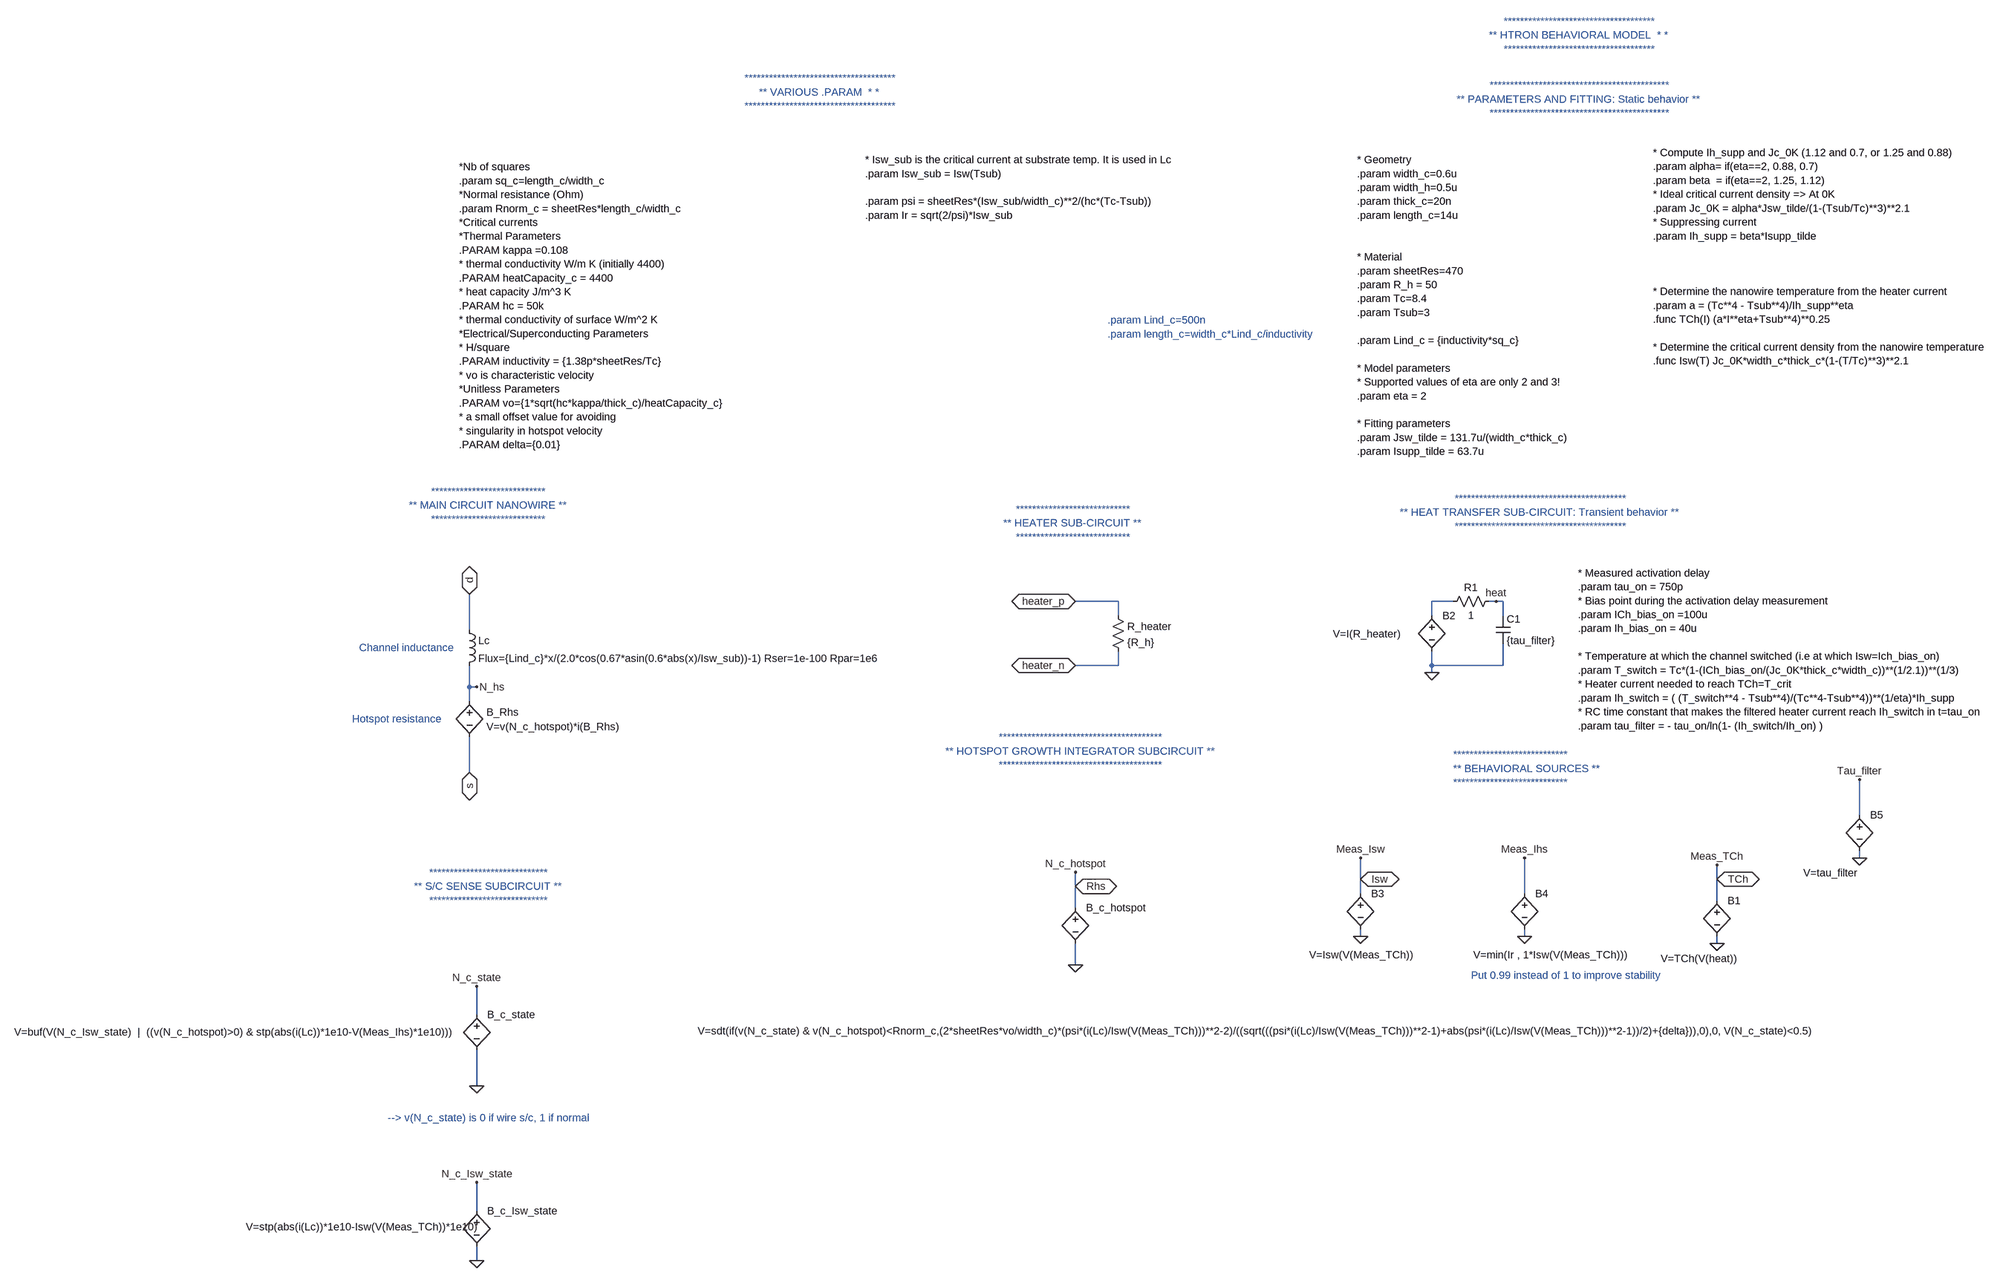
[diagram p0: schematic htron_behavioral_debug.asc]
htron_behavioral_debug.asc, the LTspice schematic file:
Version 4
SHEET 1 6584 3032
WIRE 3776 1136 3680 1136
WIRE 4528 1136 4480 1136
WIRE 4624 1136 4608 1136
WIRE 4640 1136 4624 1136
WIRE 3776 1168 3776 1136
WIRE 4480 1168 4480 1136
WIRE 4640 1168 4640 1136
WIRE 2320 1200 2320 1120
WIRE 3776 1280 3776 1248
WIRE 3776 1280 3680 1280
WIRE 4480 1280 4480 1248
WIRE 4640 1280 4640 1232
WIRE 4640 1280 4480 1280
WIRE 4480 1296 4480 1280
WIRE 2320 1328 2320 1280
WIRE 2336 1328 2320 1328
WIRE 2320 1360 2320 1328
WIRE 2320 1520 2320 1440
WIRE 5440 1616 5440 1536
WIRE 5440 1712 5440 1696
WIRE 4320 1760 4320 1712
WIRE 5120 1760 5120 1728
WIRE 3680 1776 3680 1744
WIRE 4320 1792 4320 1760
WIRE 4688 1792 4688 1712
WIRE 5120 1808 5120 1760
WIRE 3680 1824 3680 1776
WIRE 4320 1888 4320 1872
WIRE 4688 1888 4688 1872
WIRE 5120 1904 5120 1888
WIRE 3680 1952 3680 1904
WIRE 2336 2064 2336 2000
WIRE 2336 2224 2336 2144
WIRE 2336 2608 2336 2544
WIRE 2336 2720 2336 2688
FLAG 2336 2224 0
FLAG 2336 2000 N_c_state
FLAG 2336 1328 N_hs
FLAG 4688 1888 0
FLAG 4688 1712 Meas_Ihs
FLAG 5120 1904 0
FLAG 5120 1728 Meas_TCh
FLAG 2336 2720 0
FLAG 2336 2544 N_c_Isw_state
FLAG 3680 1952 0
FLAG 3680 1744 N_c_hotspot
FLAG 4480 1296 0
FLAG 2320 1120 d
IOPIN 2320 1120 BiDir
FLAG 3680 1136 heater_p
IOPIN 3680 1136 BiDir
FLAG 3680 1280 heater_n
IOPIN 3680 1280 BiDir
FLAG 2320 1520 s
IOPIN 2320 1520 BiDir
FLAG 4624 1136 heat
FLAG 4320 1888 0
FLAG 4320 1712 Meas_Isw
FLAG 4320 1760 Isw
IOPIN 4320 1760 BiDir
FLAG 5120 1760 TCh
IOPIN 5120 1760 BiDir
FLAG 3680 1776 Rhs
IOPIN 3680 1776 BiDir
FLAG 5440 1712 0
FLAG 5440 1536 Tau_filter
SYMBOL ind 2304 1184 R0
SYMATTR InstName Lc
SYMATTR Value Flux={Lind_c}*x/(2.0*cos(0.67*asin(0.6*abs(x)/Isw_sub))-1) Rser=1e-100 Rpar=1e6
SYMBOL bv 2320 1344 R0
WINDOW 0 38 41 Left 2
WINDOW 3 38 73 Left 2
SYMATTR InstName B_Rhs
SYMATTR Value V=v(N_c_hotspot)*i(B_Rhs)
SYMBOL bv 2336 2048 R0
WINDOW 3 -1038 55 Left 2
SYMATTR Value V=buf(V(N_c_Isw_state)  |  ((v(N_c_hotspot)>0) & stp(abs(i(Lc))*1e10-V(Meas_Ihs)*1e10)))
SYMATTR InstName B_c_state
SYMBOL res 3760 1152 R0
SYMATTR InstName R_heater
SYMATTR Value {R_h}
SYMBOL bv 4688 1776 R0
WINDOW 3 -115 154 Left 2
SYMATTR Value V=min(Ir , 1*Isw(V(Meas_TCh)))
SYMATTR InstName B4
SYMBOL bv 5120 1792 R0
WINDOW 3 -126 146 Left 2
SYMATTR Value V=TCh(V(heat))
SYMATTR InstName B1
SYMBOL bv 2336 2592 R0
WINDOW 3 -518 52 Left 2
SYMATTR Value V=stp(abs(i(Lc))*1e10-Isw(V(Meas_TCh))*1e10)
SYMATTR InstName B_c_Isw_state
SYMBOL bv 3680 1808 R0
WINDOW 3 -848 293 Left 2
SYMATTR Value V=sdt(if(v(N_c_state) & v(N_c_hotspot)<Rnorm_c,(2*sheetRes*vo/width_c)*(psi*(i(Lc)/Isw(V(Meas_TCh)))**2-2)/((sqrt(((psi*(i(Lc)/Isw(V(Meas_TCh)))**2-1)+abs(psi*(i(Lc)/Isw(V(Meas_TCh)))**2-1))/2)+{delta})),0),0, V(N_c_state)<0.5)
SYMATTR InstName B_c_hotspot
SYMBOL res 4624 1120 R90
WINDOW 0 0 56 VBottom 2
WINDOW 3 32 56 VTop 2
SYMATTR InstName R1
SYMATTR Value 1
SYMBOL cap 4624 1168 R0
SYMATTR InstName C1
SYMATTR Value {tau_filter}
SYMBOL bv 4480 1152 R0
WINDOW 3 -222 57 Left 2
SYMATTR Value V=I(R_heater)
SYMATTR InstName B2
SYMBOL bv 4320 1776 R0
WINDOW 3 -115 154 Left 2
SYMATTR Value V=Isw(V(Meas_TCh))
SYMATTR InstName B3
SYMBOL bv 5440 1600 R0
WINDOW 3 -126 146 Left 2
SYMATTR Value V=tau_filter
SYMATTR InstName B5
TEXT 2296 160 Left 2 !*Nb of squares\n.param sq_c=length_c/width_c\n*Normal resistance (Ohm)\n.param Rnorm_c = sheetRes*length_c/width_c\n*Critical currents\n*Thermal Parameters\n.PARAM kappa =0.108\n* thermal conductivity W/m K (initially 4400)\n.PARAM heatCapacity_c = 4400\n* heat capacity J/m^3 K \n.PARAM hc = 50k\n* thermal conductivity of surface W/m^2 K\n*Electrical/Superconducting Parameters\n* H/square\n.PARAM inductivity = {1.38p*sheetRes/Tc}\n* vo is characteristic velocity\n*Unitless Parameters\n.PARAM vo={1*sqrt(hc*kappa/thick_c)/heatCapacity_c}\n* a small offset value for avoiding\n* singularity in hotspot velocity\n.PARAM delta={0.01}
TEXT 2360 920 Center 2 ;****************************\n** MAIN CIRCUIT NANOWIRE **\n****************************
TEXT 2360 1776 Center 2 ;*****************************\n** S/C SENSE SUBCIRCUIT **\n*****************************
TEXT 2136 2296 Left 2 ;--> v(N_c_state) is 0 if wire s/c, 1 if normal
TEXT 2056 1400 Left 2 ;Hotspot resistance
TEXT 2072 1240 Left 2 ;Channel inductance
TEXT 3688 1472 Center 2 ;****************************************\n** HOTSPOT GROWTH INTEGRATOR SUBCIRCUIT **\n****************************************
TEXT 3208 144 Left 2 !* Isw_sub is the critical current at substrate temp. It is used in Lc\n.param Isw_sub = Isw(Tsub)\n \n.param psi = sheetRes*(Isw_sub/width_c)**2/(hc*(Tc-Tsub))\n.param Ir = sqrt(2/psi)*Isw_sub
TEXT 3672 960 Center 2 ;****************************\n** HEATER SUB-CIRCUIT **\n****************************
TEXT 4976 128 Left 2 !* Compute Ih_supp and Jc_0K (1.12 and 0.7, or 1.25 and 0.88)\n.param alpha= if(eta==2, 0.88, 0.7)\n.param beta  = if(eta==2, 1.25, 1.12)\n* Ideal critical current density => At 0K\n.param Jc_0K = alpha*Jsw_tilde/(1-(Tsub/Tc)**3)**2.1\n* Suppressing current\n.param Ih_supp = beta*Isupp_tilde\n \n \n \n* Determine the nanowire temperature from the heater current\n.param a = (Tc**4 - Tsub**4)/Ih_supp**eta\n.func TCh(I) (a*I**eta+Tsub**4)**0.25\n \n* Determine the critical current density from the nanowire temperature\n.func Isw(T) Jc_0K*width_c*thick_c*(1-(T/Tc)**3)**2.1
TEXT 4808 8 Center 2 ;********************************************\n** PARAMETERS AND FITTING: Static behavior **\n********************************************
TEXT 4312 144 Left 2 !* Geometry \n.param width_c=0.6u\n.param width_h=0.5u\n.param thick_c=20n\n.param length_c=14u\n \n \n* Material\n.param sheetRes=470\n.param R_h = 50\n.param Tc=8.4\n.param Tsub=3\n \n.param Lind_c = {inductivity*sq_c} \n \n* Model parameters\n* Supported values of eta are only 2 and 3!\n.param eta = 2\n \n* Fitting parameters\n.param Jsw_tilde = 131.7u/(width_c*thick_c)\n.param Isupp_tilde = 63.7u
TEXT 3104 -8 Center 2 ;*************************************\n** VARIOUS .PARAM  * *\n*************************************
TEXT 4528 1480 Left 2 ;****************************\n** BEHAVIORAL SOURCES **\n****************************
TEXT 4720 936 Center 2 ;******************************************\n** HEAT TRANSFER SUB-CIRCUIT: Transient behavior **\n******************************************
TEXT 4568 1976 Left 2 ;Put 0.99 instead of 1 to improve stability
TEXT 4808 1072 Left 2 !* Measured activation delay\n.param tau_on = 750p\n* Bias point during the activation delay measurement\n.param ICh_bias_on =100u\n.param Ih_bias_on = 40u\n \n* Temperature at which the channel switched (i.e at which Isw=Ich_bias_on)\n.param T_switch = Tc*(1-(ICh_bias_on/(Jc_0K*thick_c*width_c))**(1/2.1))**(1/3)\n* Heater current needed to reach TCh=T_crit\n.param Ih_switch = ( (T_switch**4 - Tsub**4)/(Tc**4-Tsub**4))**(1/eta)*Ih_supp\n* RC time constant that makes the filtered heater current reach Ih_switch in t=tau_on\n.param tau_filter = - tau_on/ln(1- (Ih_switch/Ih_on) )
TEXT 4808 -136 Center 2 ;*************************************\n** HTRON BEHAVIORAL MODEL  * *\n*************************************
TEXT 3752 504 Left 2 ;.param Lind_c=500n\n.param length_c=width_c*Lind_c/inductivity

The netlist it stands for:
* htron_behavioral_debug.asc
Lc d N_hs Flux={Lind_c}*x/(2.0*cos(0.67*asin(0.6*abs(x)/Isw_sub))-1) Rser=1e-100 Rpar=1e6
B_Rhs N_hs s V=v(N_c_hotspot)*i(B_Rhs)
B_c_state N_c_state 0 V=buf(V(N_c_Isw_state)  |  ((v(N_c_hotspot)>0) & stp(abs(i(Lc))*1e10-V(Meas_Ihs)*1e10)))
R_heater heater_p heater_n {R_h}
B4 Meas_Ihs 0 V=min(Ir , 1*Isw(V(Meas_TCh)))
B1 TCh 0 V=TCh(V(heat))
B_c_Isw_state N_c_Isw_state 0 V=stp(abs(i(Lc))*1e10-Isw(V(Meas_TCh))*1e10)
B_c_hotspot Rhs 0 V=sdt(if(v(N_c_state) & v(N_c_hotspot)<Rnorm_c,(2*sheetRes*vo/width_c)*(psi*(i(Lc)/Isw(V(Meas_TCh)))**2-2)/((sqrt(((psi*(i(Lc)/Isw(V(Meas_TCh)))**2-1)+abs(psi*(i(Lc)/Isw(V(Meas_TCh)))**2-1))/2)+{delta})),0),0, V(N_c_state)<0.5)
R1 heat N001 1
C1 heat 0 {tau_filter}
B2 N001 0 V=I(R_heater)
B3 Isw 0 V=Isw(V(Meas_TCh))
B5 Tau_filter 0 V=tau_filter
*Nb of squares
.param sq_c=length_c/width_c
*Normal resistance (Ohm)
.param Rnorm_c = sheetRes*length_c/width_c
*Critical currents
*Thermal Parameters
.PARAM kappa =0.108
* thermal conductivity W/m K (initially 4400)
.PARAM heatCapacity_c = 4400
* heat capacity J/m^3 K
.PARAM hc = 50k
* thermal conductivity of surface W/m^2 K
*Electrical/Superconducting Parameters
* H/square
.PARAM inductivity = {1.38p*sheetRes/Tc}
* vo is characteristic velocity
*Unitless Parameters
.PARAM vo={1*sqrt(hc*kappa/thick_c)/heatCapacity_c}
* a small offset value for avoiding
* singularity in hotspot velocity
.PARAM delta={0.01}
* ****************************
* ** MAIN CIRCUIT NANOWIRE **
* ****************************
* *****************************
* ** S/C SENSE SUBCIRCUIT **
* *****************************
* --> v(N_c_state) is 0 if wire s/c, 1 if normal
* Hotspot resistance
* Channel inductance
* ****************************************
* ** HOTSPOT GROWTH INTEGRATOR SUBCIRCUIT **
* ****************************************
* Isw_sub is the critical current at substrate temp. It is used in Lc
.param Isw_sub = Isw(Tsub)
.param psi = sheetRes*(Isw_sub/width_c)**2/(hc*(Tc-Tsub))
.param Ir = sqrt(2/psi)*Isw_sub
* ****************************
* ** HEATER SUB-CIRCUIT **
* ****************************
* Compute Ih_supp and Jc_0K (1.12 and 0.7, or 1.25 and 0.88)
.param alpha= if(eta==2, 0.88, 0.7)
.param beta  = if(eta==2, 1.25, 1.12)
* Ideal critical current density => At 0K
.param Jc_0K = alpha*Jsw_tilde/(1-(Tsub/Tc)**3)**2.1
* Suppressing current
.param Ih_supp = beta*Isupp_tilde
* Determine the nanowire temperature from the heater current
.param a = (Tc**4 - Tsub**4)/Ih_supp**eta
.func TCh(I) (a*I**eta+Tsub**4)**0.25
* Determine the critical current density from the nanowire temperature
.func Isw(T) Jc_0K*width_c*thick_c*(1-(T/Tc)**3)**2.1
* ********************************************
* ** PARAMETERS AND FITTING: Static behavior **
* ********************************************
* Geometry
.param width_c=0.6u
.param width_h=0.5u
.param thick_c=20n
.param length_c=14u
* Material
.param sheetRes=470
.param R_h = 50
.param Tc=8.4
.param Tsub=3
.param Lind_c = {inductivity*sq_c}
* Model parameters
* Supported values of eta are only 2 and 3!
.param eta = 2
* Fitting parameters
.param Jsw_tilde = 131.7u/(width_c*thick_c)
.param Isupp_tilde = 63.7u
* *************************************
* ** VARIOUS .PARAM  * *
* *************************************
* ****************************
* ** BEHAVIORAL SOURCES **
* ****************************
* ******************************************
* ** HEAT TRANSFER SUB-CIRCUIT: Transient behavior **
* ******************************************
* Put 0.99 instead of 1 to improve stability
* Measured activation delay
.param tau_on = 750p
* Bias point during the activation delay measurement
.param ICh_bias_on =100u
.param Ih_bias_on = 40u
* Temperature at which the channel switched (i.e at which Isw=Ich_bias_on)
.param T_switch = Tc*(1-(ICh_bias_on/(Jc_0K*thick_c*width_c))**(1/2.1))**(1/3)
* Heater current needed to reach TCh=T_crit
.param Ih_switch = ( (T_switch**4 - Tsub**4)/(Tc**4-Tsub**4))**(1/eta)*Ih_supp
* RC time constant that makes the filtered heater current reach Ih_switch in t=tau_on
.param tau_filter = - tau_on/ln(1- (Ih_switch/Ih_on) )
* *************************************
* ** HTRON BEHAVIORAL MODEL  * *
* *************************************
* .param Lind_c=500n
* .param length_c=width_c*Lind_c/inductivity
.backanno
.end